# EAGLE design Cab_Board (EAGLE 8.3.2)
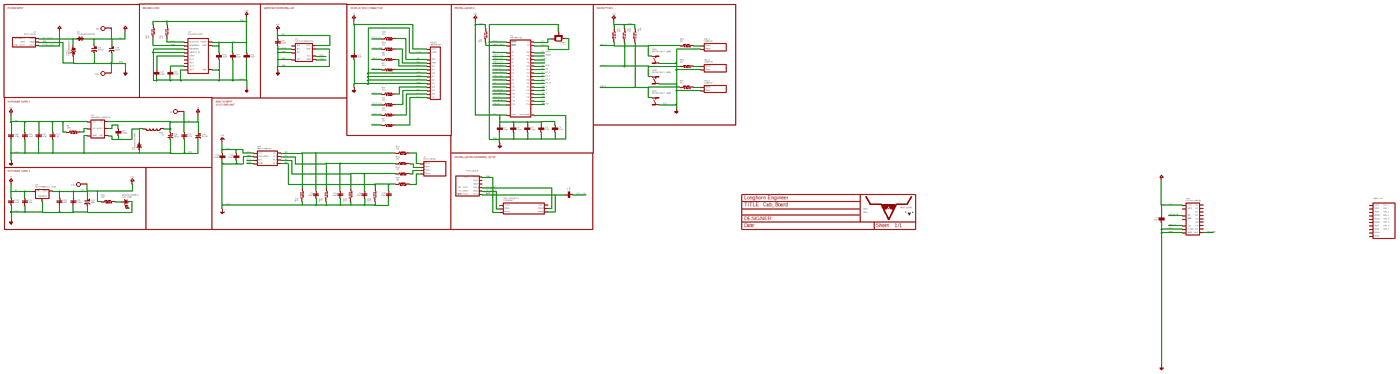
[diagram p0: schematic, sheet 1, overview]
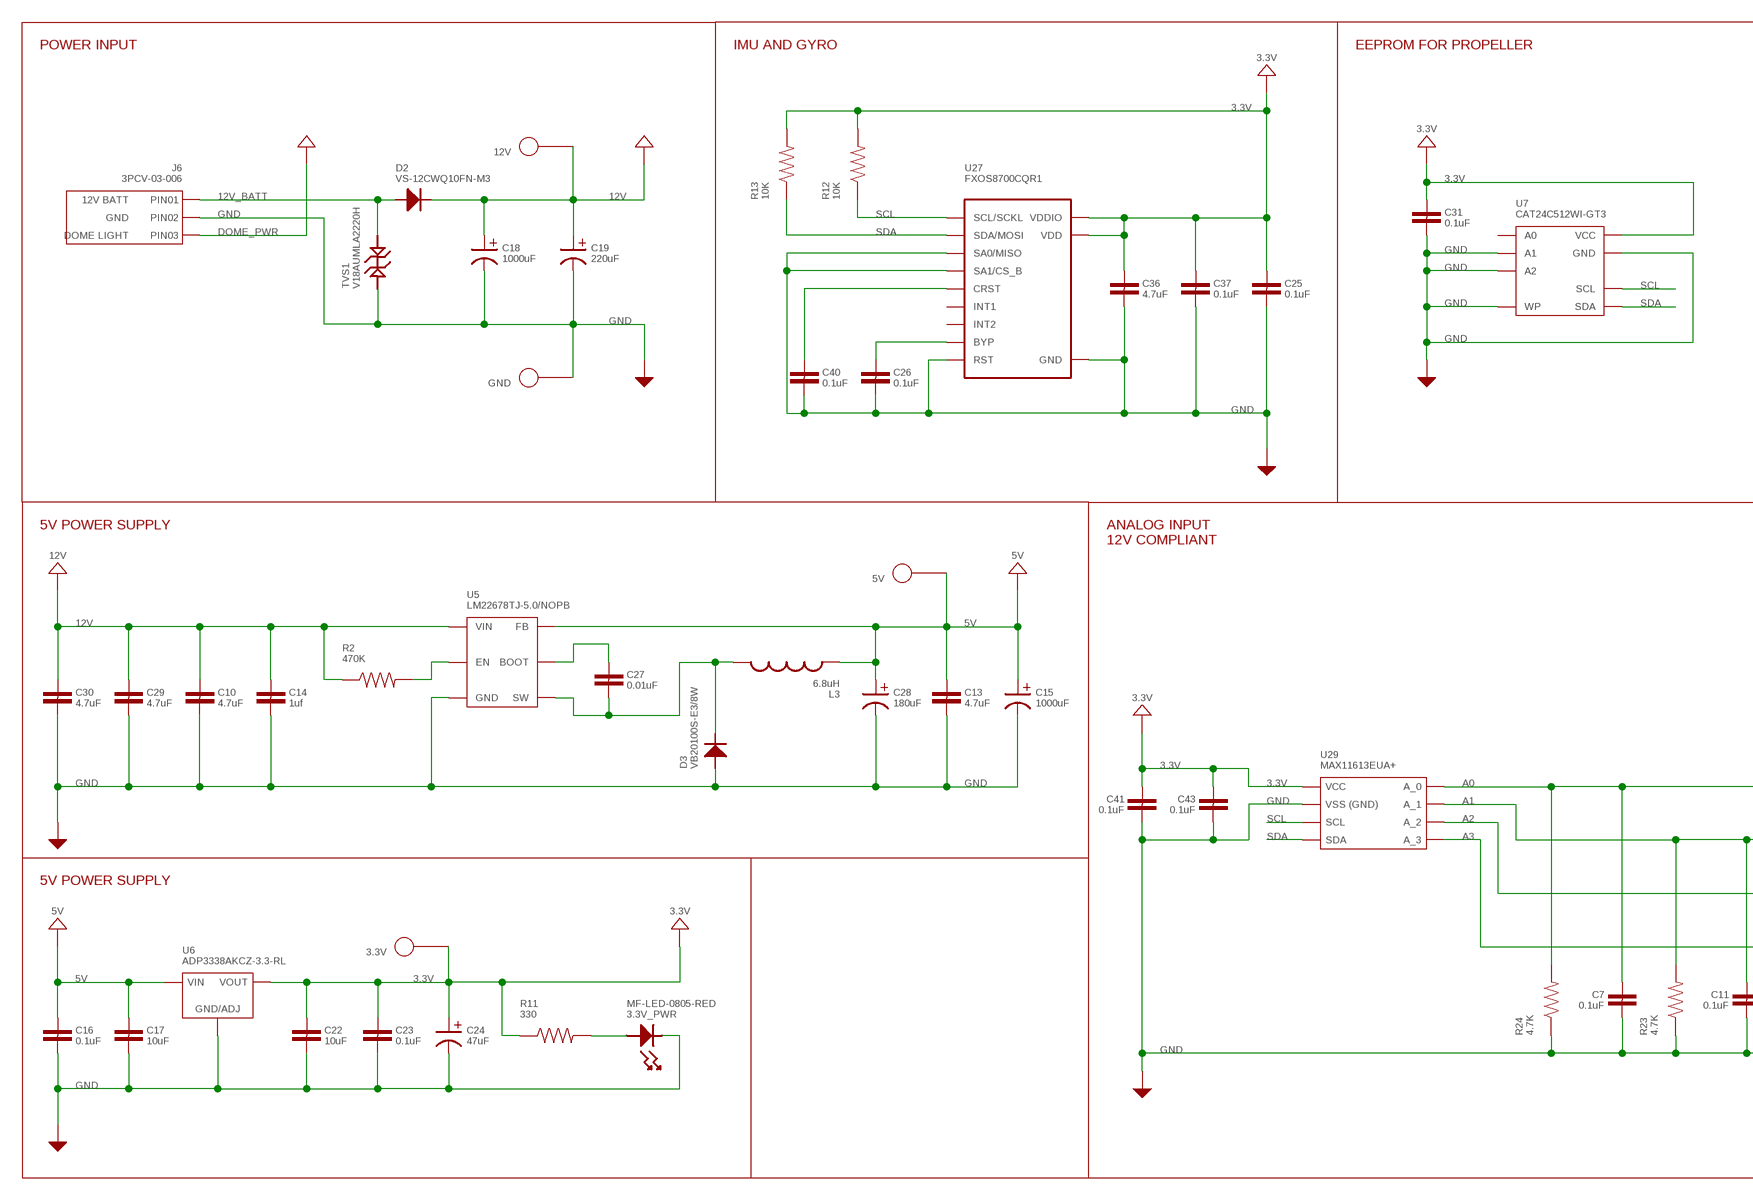
[diagram p1: schematic, sheet 1, part 1 of 4]
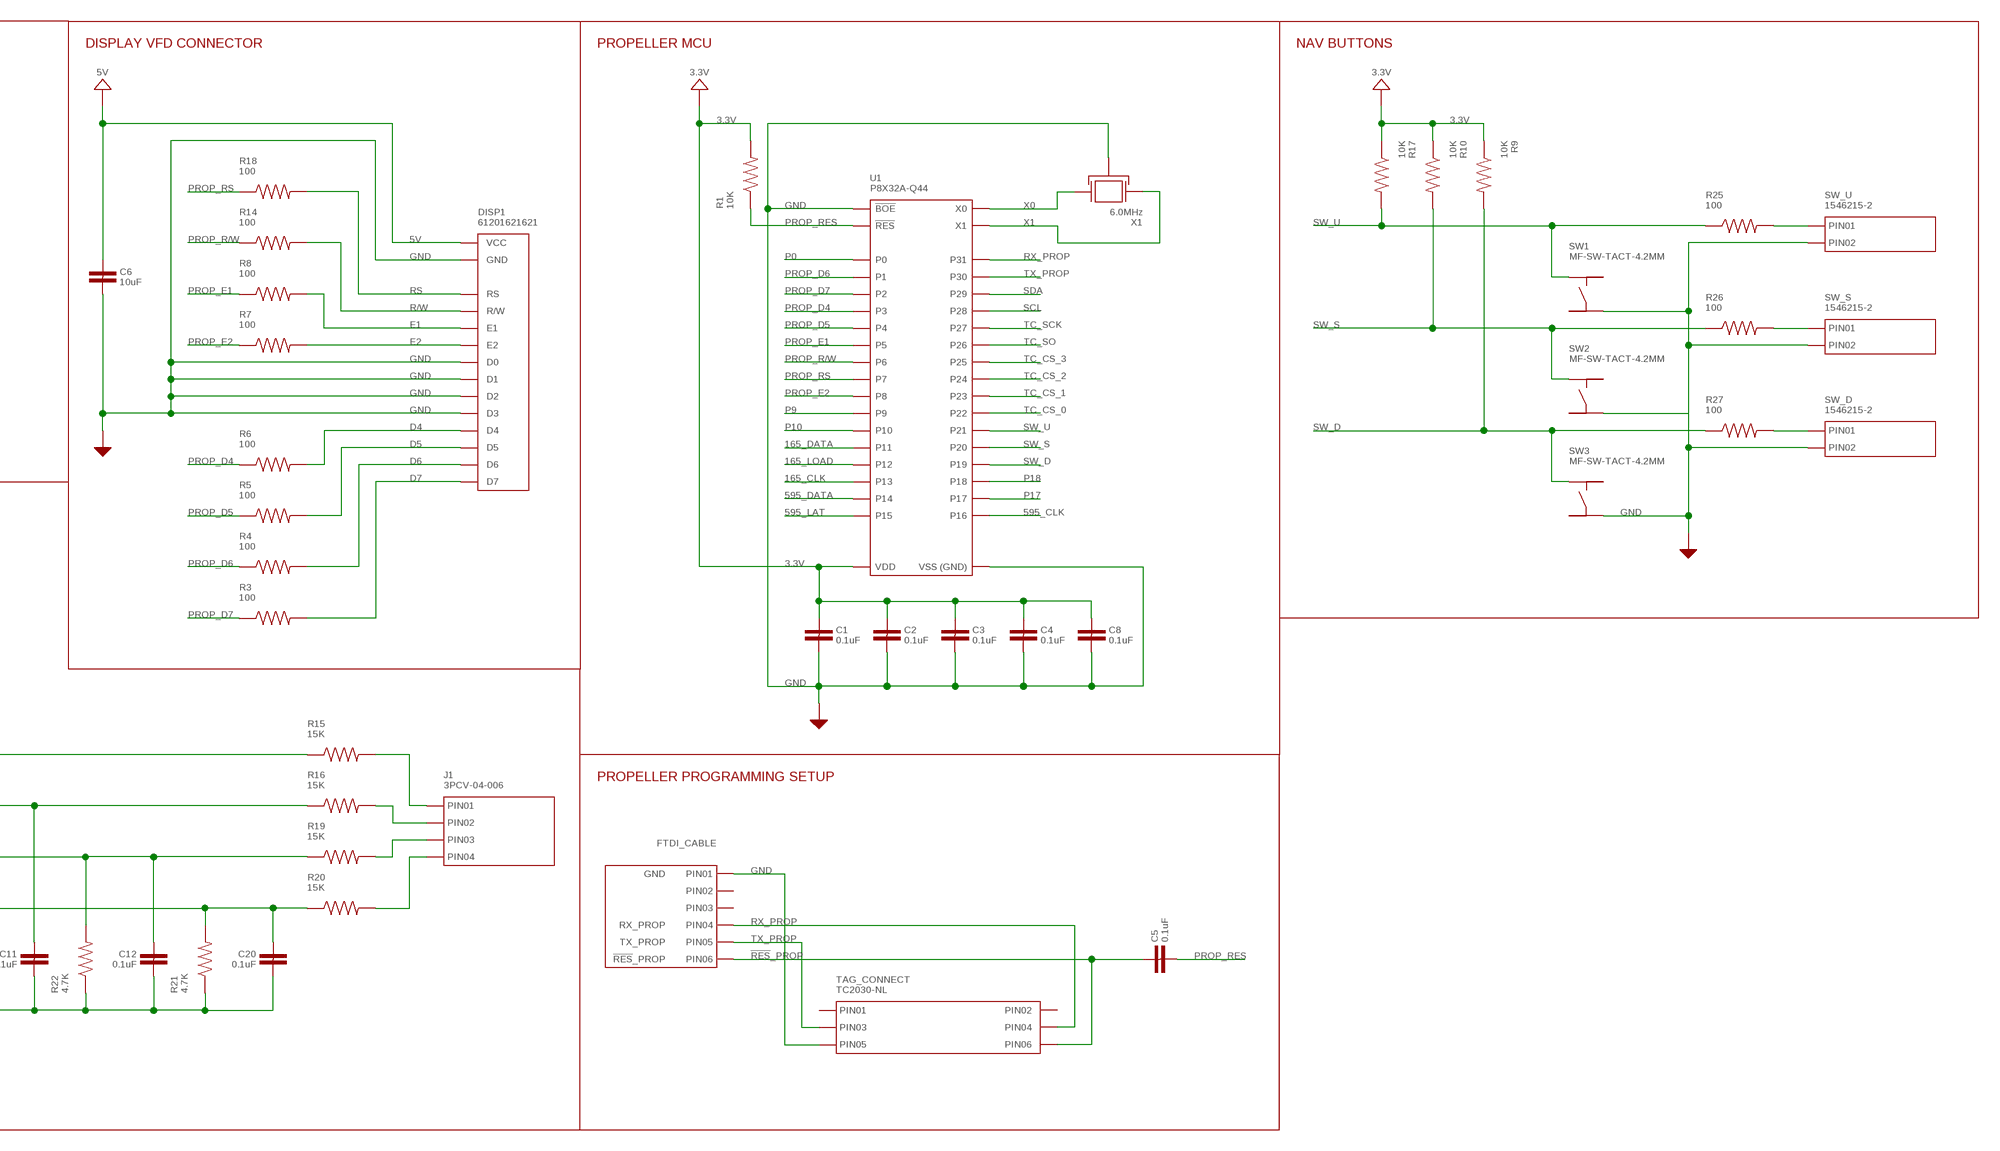
[diagram p2: schematic, sheet 1, part 2 of 4]
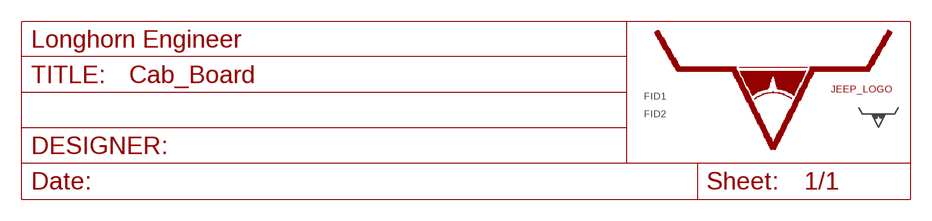
[diagram p3: schematic, sheet 1, part 3 of 4]
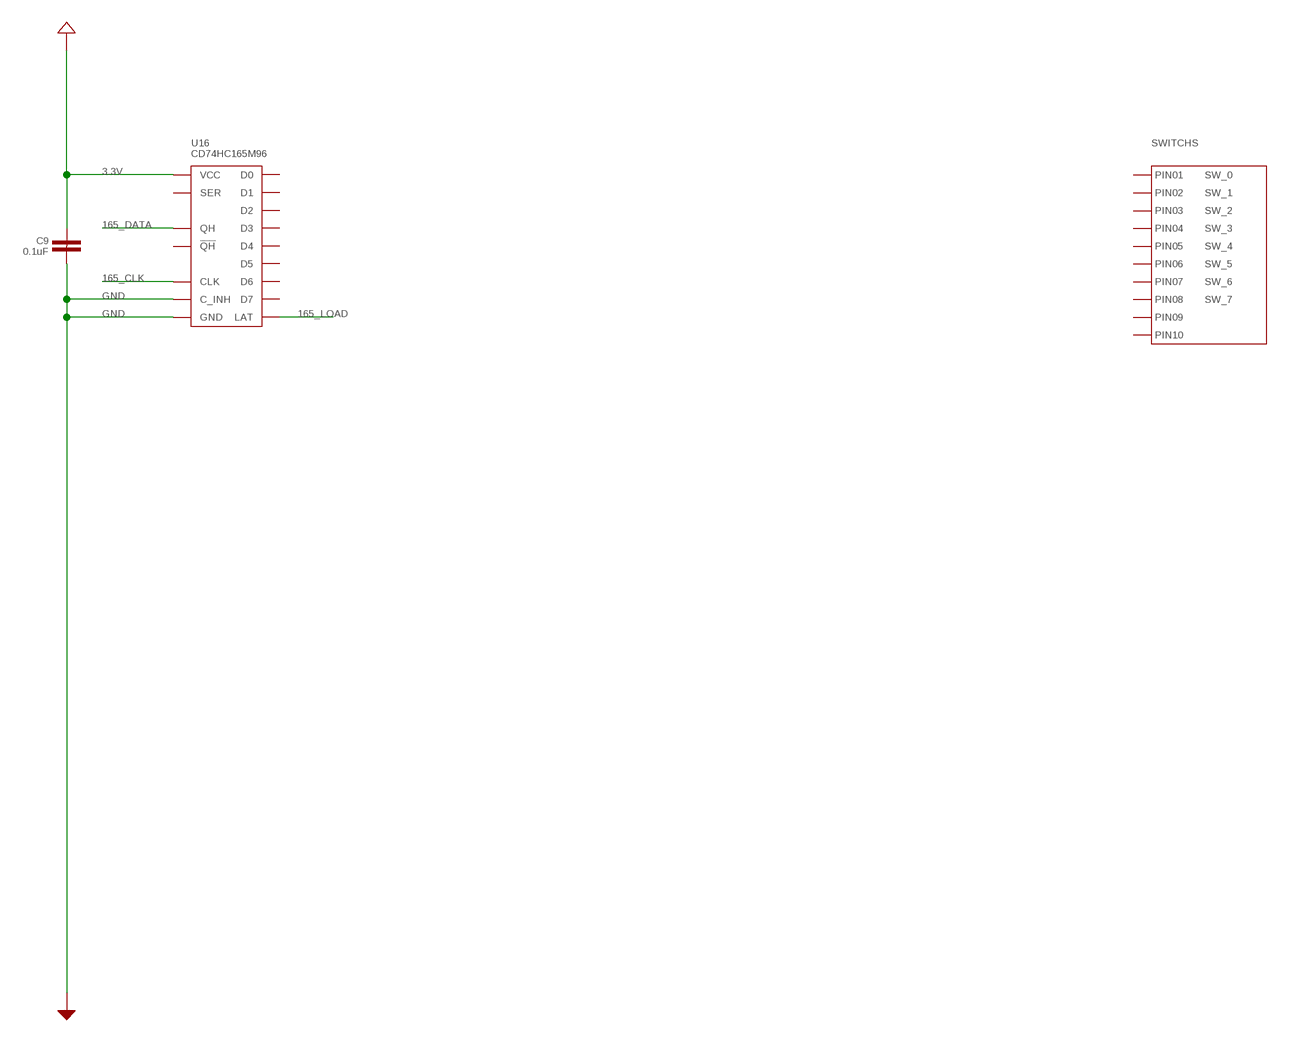
[diagram p4: schematic, sheet 1, part 4 of 4]

## Parts
3.3V  TEST_POINT_SINGLE_KEYSTONE_5115-5119  [KEYSTONE_5115-5119]
3.3V_PWR  MF-LED-0805-RED  LED_SINGLE_0805  [LED_0805]
5V  TEST_POINT_SINGLE_KEYSTONE_5115-5119  [KEYSTONE_5115-5119]
12V  TEST_POINT_SINGLE_KEYSTONE_5115-5119  [KEYSTONE_5115-5119]
C1  0.1uF  CAPACITOR_NON_POLAR_0805  [0805]
C2  0.1uF  CAPACITOR_NON_POLAR_0805  [0805]
C3  0.1uF  CAPACITOR_NON_POLAR_0805  [0805]
C4  0.1uF  CAPACITOR_NON_POLAR_0805  [0805]
C5  0.1uF  CAPACITOR_NON_POLAR_0603  [0603]
C6  10uF  CAPACITOR_NON_POLAR_1206  [1206]
C7  0.1uF  CAPACITOR_NON_POLAR_0805  [0805]
C8  0.1uF  CAPACITOR_NON_POLAR_0805  [0805]
C9  0.1uF  CAPACITOR_NON_POLAR_0805  [0805]
C10  4.7uF  CAPACITOR_NON_POLAR_1210  [1210]
C11  0.1uF  CAPACITOR_NON_POLAR_0805  [0805]
C12  0.1uF  CAPACITOR_NON_POLAR_0805  [0805]
C13  4.7uF  CAPACITOR_NON_POLAR_1210  [1210]
C14  1uf  CAPACITOR_NON_POLAR_0805  [0805]
C15  1000uF  CAPACITOR_POLARIZED_10MM_SMD  [10MM_CAP_SMD]
C16  0.1uF  CAPACITOR_NON_POLAR_0805  [0805]
C17  10uF  CAPACITOR_NON_POLAR_1206  [1206]
C18  1000uF  CAPACITOR_POLARIZED_12.5MM_PTH  [12.5MM_CAP_PTH]
C19  220uF  CAPACITOR_POLARIZED_10MM_SMD  [10MM_CAP_SMD]
C20  0.1uF  CAPACITOR_NON_POLAR_0805  [0805]
C22  10uF  CAPACITOR_NON_POLAR_1210  [1210]
C23  0.1uF  CAPACITOR_NON_POLAR_0805  [0805]
C24  47uF  CAPACITOR_POLARIZED_6.3MM_SMD  [6.3MM_CAP_SMD]
C25  0.1uF  CAPACITOR_NON_POLAR_0805  [0805]
C26  0.1uF  CAPACITOR_NON_POLAR_0805  [0805]
C27  0.01uF  CAPACITOR_NON_POLAR_0805  [0805]
C28  180uF  CAPACITOR_POLARIZED_8MM_SMD  [8MM_CAP_SMD]
C29  4.7uF  CAPACITOR_NON_POLAR_1210  [1210]
C30  4.7uF  CAPACITOR_NON_POLAR_1210  [1210]
C31  0.1uF  CAPACITOR_NON_POLAR_0805  [0805]
C36  4.7uF  CAPACITOR_NON_POLAR_1206  [1206]
C37  0.1uF  CAPACITOR_NON_POLAR_0805  [0805]
C40  0.1uF  CAPACITOR_NON_POLAR_0805  [0805]
C41  0.1uF  CAPACITOR_NON_POLAR_0805  [0805]
C43  0.1uF  CAPACITOR_NON_POLAR_0805  [0805]
D2  VS-12CWQ10FN-M3  DIODE_D-PAK(TO-252AA)  [D-PAK(TO-252AA)]
D3  VB20100S-E3/8W  DIODE_D2PAK(TO-263AB)  [D2PAK(TO-263AB)]
DISP1  61201621621  CU40056-UW1J  [CU40045-UW1J]
FID1  FIDUCIAL_0.5MM  [FIDUCIAL_0.5MM]
FID2  FIDUCIAL_0.5MM  [FIDUCIAL_0.5MM]
FTDI_CABLE  CON_01X06_2.54MM_PIN_HEADER  [2.54MM_01X06_PIN_HEADER]
GND  TEST_POINT_SINGLE_KEYSTONE_5115-5119  [KEYSTONE_5115-5119]
J1  3PCV-04-006  CON_01X04_3PCV-04-006  [3PCV-04-006]
J6  3PCV-03-006  CON_01X03_3PV-03-006  [3PCV-03-006]
L3  6.8uH  INDUCTOR_IHLP-5050  [IHLP-5050]
R1  10K  RESISTOR_0805  [0805]
R2  470K  RESISTOR_0603  [0603]
R3  100  RESISTOR_0603  [0603]
R4  100  RESISTOR_0603  [0603]
R5  100  RESISTOR_0603  [0603]
R6  100  RESISTOR_0603  [0603]
R7  100  RESISTOR_0603  [0603]
R8  100  RESISTOR_0603  [0603]
R9  10K  RESISTOR_0603  [0603]
R10  10K  RESISTOR_0603  [0603]
R11  330  RESISTOR_0603  [0603]
R12  10K  RESISTOR_0603  [0603]
R13  10K  RESISTOR_0603  [0603]
R14  100  RESISTOR_0603  [0603]
R15  15K  RESISTOR_0603  [0603]
R16  15K  RESISTOR_0603  [0603]
R17  10K  RESISTOR_0603  [0603]
R18  100  RESISTOR_0603  [0603]
R19  15K  RESISTOR_0603  [0603]
R20  15K  RESISTOR_0603  [0603]
R21  4.7K  RESISTOR_0603  [0603]
R22  4.7K  RESISTOR_0603  [0603]
R23  4.7K  RESISTOR_0603  [0603]
R24  4.7K  RESISTOR_0603  [0603]
R25  100  RESISTOR_0603  [0603]
R26  100  RESISTOR_0603  [0603]
R27  100  RESISTOR_0603  [0603]
SW1  MF-SW-TACT-4.2MM  TACT_4.2MM  [TACT4.2MM]
SW2  MF-SW-TACT-4.2MM  TACT_4.2MM  [TACT4.2MM]
SW3  MF-SW-TACT-4.2MM  TACT_4.2MM  [TACT4.2MM]
SW_D  1546215-2  CON_01X02_1546215-2  [1546215-2]
SW_S  1546215-2  CON_01X02_1546215-2  [1546215-2]
SW_U  1546215-2  CON_01X02_1546215-2  [1546215-2]
SWITCHS  CON_01X10_1-282834-0  [1-282834-0]
TAG_CONNECT  TC2030-NL  CON_02X03_TC2030  [TC2030]
TVS1  V18AUMLA2220H  TVS_DIODE_2220  [2220]
U1  P8X32A-Q44  [LQFP44]
U5  LM22678TJ-5.0/NOPB  LM22678  [LM22678_TO-263-EP-7]
U6  ADP3338AKCZ-3.3-RL  LINEAR_VOTLAGE_REGULATORS_ADP3338  [ADP3338_SOT-223-3]
U7  CAT24C512WI-GT3  EEPROM_I2CSOIC-8_W  [SOIC-8_W]
U16  CD74HC165M96  [CD74HC165_SOIC-16]
U27  FXOS8700CQR1  [FXOS8700CQR1]
U29  MAX11613EUA+  [MAX11613_UMAX-8]
U$1  LHE_FRAME  [LHE_FRAME]
U$35  JEEP_LOGO_SILK_MEDIUM  [JEEP_SILK_MEDIUM]
U$42  LHE_LOGOLHE_LOGO  [LHE_LOGO]
X1  6.0MHz  CYRSTAL_GND_ABMM  [7MMX5MM]

## Nets
3.3V: 3.3V.P$1 C1.1 C2.1 C3.1 C4.1 C8.1 C9.1 C22.1 C23.1 C24.POS C25.1 C31.1 C36.1 C37.1 C41.1 C43.1 R1.2 R9.1 R10.1 R11.1 R12.2 R13.2 R17.1 U1.8(VDD) U1.18(VDD) U1.30(VDD) U1.40(VDD) U6.2(OUT) U6.PAD(OUT) U7.8(VCC) U16.16(VCC) U27.P$1(VDDIO) U27.P$14(VDD) U29.P$8(VCC)
5V: 5V.P$1 C6.1 C13.1 C15.POS C16.1 C17.1 C28.POS DISP1.P$13(VCC) L3.1 U5.P$6(FB) U6.3(IN)
12V: 12V.P$1 C10.1 C14.1 C18.POS C19.POS C29.1 C30.1 D2.PAD-4(CATHODE) R2.1 U5.P$2(VIN)
12V_BATT: D2.1(ANODE) D2.3(ANODE) J6.1(PIN1) TVS1.P$2
165_CLK: U1.14(P13) U16.2(CLK)
165_DATA: U1.12(P11) U16.9(QH)
165_LOAD: U1.13(P12) U16.1(LAT)
595_CLK: U1.19(P16)
595_DATA: U1.15(P14)
595_LAT: U1.16(P15)
!RES!_PROP: C5.1 FTDI_CABLE.6 TAG_CONNECT.P$6(PIN6)
A0: C7.1 R15.1 R24.2 U29.P$1(A_0)
A1: C11.1 R16.1 R23.2 U29.P$2(A_1)
A2: C12.1 R19.1 R22.2 U29.P$3(A_2)
A3: C20.1 R20.1 R21.2 U29.P$4(A_3)
D4: DISP1.P$3(D4) R6.2
D5: DISP1.P$4(D5) R5.2
D6: DISP1.P$1(D6) R4.2
D7: DISP1.P$2(D7) R3.2
DOME_PWR: J6.3(PIN3)
E1: DISP1.P$10(E1) R8.2
E2: DISP1.P$16(E2) R7.2
GND: 3.3V_PWR.CATHODE C1.2 C2.2 C3.2 C4.2 C6.2 C7.2 C8.2 C9.2 C10.2 C11.2 C12.2 C13.2 C14.2 C15.NEG C16.2 C17.2 C18.NEG C19.NEG C20.2 C22.2 C23.2 C24.NEG C25.2 C26.2 C28.NEG C29.2 C30.2 C31.2 C36.2 C37.2 C40.2 C41.2 C43.2 D3.A(ANODE) DISP1.P$5(D2) DISP1.P$6(D3) DISP1.P$7(D0) DISP1.P$8(D1) DISP1.P$14(GND) FTDI_CABLE.1 GND.P$1 J6.2(PIN2) R21.1 R22.1 R23.1 R24.1 SW1.P$4 SW2.P$4 SW3.P$4 SW_D.P$2(PIN2) SW_S.P$2(PIN2) SW_U.P$2(PIN2) TAG_CONNECT.P$5(PIN5) TVS1.P$1 U1.5(VSS) U1.6(BOE') U1.17(VSS) U1.27(VSS) U1.39(VSS) U5.P$4(GND) U5.PAD(GND) U6.1(GND) U7.2(A1) U7.3(A2) U7.4(GND) U7.7(WP) U16.8(GND) U16.15(C_INH) U27.P$3(GND) U27.P$5(GND) U27.P$7(SA0/MISO) U27.P$10(SA1/CS_B) U27.P$12(GND) U27.P$13(GND) U27.P$16(RST) U29.P$7(GND) X1.P$2(GND) X1.P$4(GND)
N$1: J1.1 R15.2
N$2: C27.1 U5.P$3(BOOT)
N$3: J1.2 R16.2
N$4: J1.3 R19.2
N$5: C27.2 D3.C(CATHODE) L3.2 U5.P$1(SW)
N$6: J1.4 R20.2
N$7: C26.1 U27.P$2(BYP)
N$8: C40.1 U27.P$8(CRST)
N$9: 3.3V_PWR.ANODE R11.2
N$10: R25.2 SW_U.P$1(PIN1)
N$11: R26.2 SW_S.P$1(PIN1)
N$12: R27.2 SW_D.P$1(PIN1)
N$31: R2.2 U5.P$7(EN)
P0: U1.41(P0)
P9: U1.10(P9)
P10: U1.11(P10)
P17: U1.20(P17)
P18: U1.21(P18)
PROP_D4: R6.1 U1.44(P3)
PROP_D5: R5.1 U1.1(P4)
PROP_D6: R4.1 U1.42(P1)
PROP_D7: R3.1 U1.43(P2)
PROP_E1: R8.1 U1.2(P5)
PROP_E2: R7.1 U1.9(P8)
PROP_R/W: R14.1 U1.3(P6)
PROP_RES: C5.2 R1.1 U1.7(RES')
PROP_RS: R18.1 U1.4(P7)
R/W: DISP1.P$9(R/W) R14.2
RS: DISP1.P$12(RS) R18.2
RX_PROP: FTDI_CABLE.4 TAG_CONNECT.P$4(PIN4) U1.38(P31)
SCL: R12.1 U1.35(P28) U7.6(SCL) U27.P$4(SCL/SCKL) U29.P$5(SCL)
SDA: R13.1 U1.36(P29) U7.5(SDA) U27.P$6(SDA/MOSI) U29.P$6(SDA)
SW_D: R9.2 R27.1 SW3.P$1 U1.22(P19)
SW_S: R10.2 R26.1 SW2.P$1 U1.23(P20)
SW_U: R17.2 R25.1 SW1.P$1 U1.24(P21)
TC_CS_0: U1.25(P22)
TC_CS_1: U1.26(P23)
TC_CS_2: U1.31(P24)
TC_CS_3: U1.32(P25)
TC_SCK: U1.34(P27)
TC_SO: U1.33(P26)
TX_PROP: FTDI_CABLE.5 TAG_CONNECT.P$3(PIN3) U1.37(P30)
X0: U1.29(X0) X1.P$3(X1)
X1: U1.28(X1) X1.P$1(X0)
Unconnected: FTDI_CABLE.2 FTDI_CABLE.3 SW1.P$2 SW1.P$3 SW2.P$2 SW2.P$3 SW3.P$2 SW3.P$3 SWITCHS.P$1 SWITCHS.P$2 SWITCHS.P$3 SWITCHS.P$4 SWITCHS.P$5 SWITCHS.P$6 SWITCHS.P$7 SWITCHS.P$8 SWITCHS.P$9 SWITCHS.P$10 TAG_CONNECT.P$1(PIN1) TAG_CONNECT.P$2(PIN2) U7.1(A0) U16.3(D4) U16.4(D5) U16.5(D6) U16.6(D7) U16.7(QH') U16.10(SER) U16.11(D0) U16.12(D1) U16.13(D2) U16.14(D3) U27.P$9(INT2) U27.P$11(INT1)

## Notes on the sheet
- POWER INPUT | IMU AND GYRO | EEPROM FOR PROPELLER | DISPLAY VFD CONNECTOR | PROPELLER MCU | NAV BUTTONS
- 5V POWER SUPPLY
- ANALOG INPUT
  12V COMPLIANT
- PROPELLER PROGRAMMING SETUP
- 5V POWER SUPPLY

## Library data of the parts
3.3V = PP_Connectors:TEST_POINT_SINGLE; POPULATE: 1
3.3V_PWR = PP_LED:LED_SINGLE; MPN: MF-LED-0805-RED
5V 12V GND = PP_Connectors:TEST_POINT_SINGLE; MPN: 5115; POPULATE: 1
C1-C5 C7 C8 C11 C12 C16 C20 C23 C25 C26 C31 C37 C40 C41 C43 = PP_Passives:CAPACITOR_NON_POLAR: Capacitor Non Polarized; MPN: MF-CAP-0805-0.1uF
C6 C17 C22 = PP_Passives:CAPACITOR_NON_POLAR: Capacitor Non Polarized; MPN: MF-CAP-1206-10uF
C9 = PP_Passives:CAPACITOR_NON_POLAR: Capacitor Non Polarized
C10 C13 C29 C30 C36 = PP_Passives:CAPACITOR_NON_POLAR: Capacitor Non Polarized; MPN: GRJ32DC72A475KE11L
C14 = PP_Passives:CAPACITOR_NON_POLAR: Capacitor Non Polarized; MPN: C0805C105K5RACTU
C15 = PP_Passives:CAPACITOR_POLARIZED: Polarized capacitors; MPN: UWZ1A102MCL1GS
C18 = PP_Passives:CAPACITOR_POLARIZED: Polarized capacitors; MPN: UBW1H102MHD
C19 = PP_Passives:CAPACITOR_POLARIZED: Polarized capacitors; MPN: UWZ1H221MCL1GS
C24 = PP_Passives:CAPACITOR_POLARIZED: Polarized capacitors; MPN: UWJ1C470MCL1GB
C27 = PP_Passives:CAPACITOR_NON_POLAR: Capacitor Non Polarized; MPN: C0805C103K5RACTU
C28 = PP_Passives:CAPACITOR_POLARIZED: Polarized capacitors; MPN: 16SVP180M
D2 = PP_Passives:DIODE: Diode - Single; MPN: VS-12CWQ10FN-M3
D3 = PP_Passives:DIODE: Diode - Single
DISP1 = PP_Displays:CU40056-UW1J; MPN: 61201621621
FID1 FID2 = MF_Aesthetics:FIDUCIAL: Library: MF_Aesthetics Description: Fiducial marking for PCB alignment inside PNP and other machines.; HOUSEPART: NO; POPULATE: 0
FTDI_CABLE = PP_Connectors:CON_01X06: 6 pin connectors; LABEL01: GND; LABEL04: RX_PROP; LABEL05: TX_PROP; LABEL06: !RES!_PROP; POPULATE: 1
J1 = PP_Connectors:CON_01X04: 4 Pin Connectors; LABEL01: ANALOG 0; LABEL02: ANALOG 1; LABEL03: ANALOG 3; LABEL04: ANALOG 4; MPN: 3PCV-04-006
J6 = PP_Connectors:CON_01X03: 3 pin connectors; LABEL01: 12V BATT; LABEL02: GND; LABEL03: DOME LIGHT; MPN: 3PCV-03-006; POPULATE: 1
L3 = PP_Passives:INDUCTOR: Inductors; MPN: IHLP5050CEER6R8M01
R1 = PP_Passives:RESISTOR: Resistors
R2 = PP_Passives:RESISTOR: Resistors; MPN: MF-RES-0603-470K
R3-R8 R14 R18 R25-R27 = PP_Passives:RESISTOR: Resistors; MPN: MF-RES-0603-100
R9 R10 R12 R13 R17 = PP_Passives:RESISTOR: Resistors; MPN: MF-RES-0603-10K
R11 = PP_Passives:RESISTOR: Resistors; MPN: MF-RES-0603-330
R15 R16 R19 R20 = PP_Passives:RESISTOR: Resistors; MPN: MF-RES-0603-15K
R21-R24 = PP_Passives:RESISTOR: Resistors; MPN: MF-RES-0603-4.7K
SW1-SW3 = MF_Switches:TACT: Library: MF_Switches Description: Device for Tact Switches. Manufacture part number (MFG#) can be added via Attributes.; HOUSEPART: YES; MPN: MF-SW-TACT-4.2MM; POPULATE: 1; URL: https://factory.macrofab.com/part/MF-SW-TACT-4.2MM
SW_D SW_S SW_U = PP_Connectors:CON_01X02; MPN: 1546215-2; POPULATE: 1
SWITCHS = PP_Connectors:CON_01X10; LABEL01: SW_0; LABEL02: SW_1; LABEL03: SW_2; LABEL04: SW_3; LABEL05: SW_4; LABEL06: SW_5; LABEL07: SW_6; LABEL08: SW_7; POPULATE: 1
TAG_CONNECT = PP_Connectors:CON_02X03; POPULATE: 0
TVS1 = PP_Passives:TVS_DIODE
U1 = MF_IC_Digital:P8X32A: Manufacturer Part #: P8X32A Manufacturer: Parallax Description: 32-bit Microcontrollers - MCU LQFP pkg Propeller Chip; HOUSEPART: NO; MPN: P8X32A-Q44; POPULATE: 1; URL: https://www.parallax.com/sites/default/files/downloads/P8X32A-Propeller-Datasheet-v1.4.0_0.pdf
U5 = PP_PowerIC:LM22678: Manufacturer Part #: LM22678 Manufacturer: Texas Instruments Description: Voltage Regulators - Switching Regulators 5A STEP-DOWN VLTG REG; MPN: LM22678TJ-5.0/NOPB
U6 = PP_PowerIC:LINEAR_VOTLAGE_REGULATORS; MPN: ADP3338AKCZ-3.3-RL
U7 = PP_DigitalIC:EEPROM_I2C; MPN: CAT24C512WI-GT3
U16 = PP_DigitalIC:CD74HC165: Manufacturer Part #: CD74HC165 Manufacturer: Texas Instruments Description: Counter Shift Registers High Speed CMOS 8-Bit Shift Register
U27 = PP_Sensors:FXOS8700CQR1; MPN: FXOS8700CQR1
U29 = PP_AnalogIC:MAX11613: Manufacturer Part #: MAX11613 Manufacturer: Maxim Integrated Description: Analog to Digital Converters - ADC 12-Bit 4Ch 94.4sps 3.6V Precision ADC; MPN: MAX11613EUA+; POPULATE: 1
U$1 = PP_Aesthetics:LHE_FRAME; DNAME: Parker Dillmann; REVNUM: REV: 1
U$35 = PP_Aesthetics:JEEP_LOGO
U$42 = PP_Aesthetics:LHE_LOGO
X1 = MF_Frequency_Control:CYRSTAL_GND: Library: MF_Frequency_Control Description: Device for two functional pin Cyrstal Oscillators and a ground.; HOUSEPART: NO; MPN: ABMM-6.000MHZ-B2-T; POPULATE: 1; URL: http://www.abracon.com/Resonators/ABMM.pdf

## Board
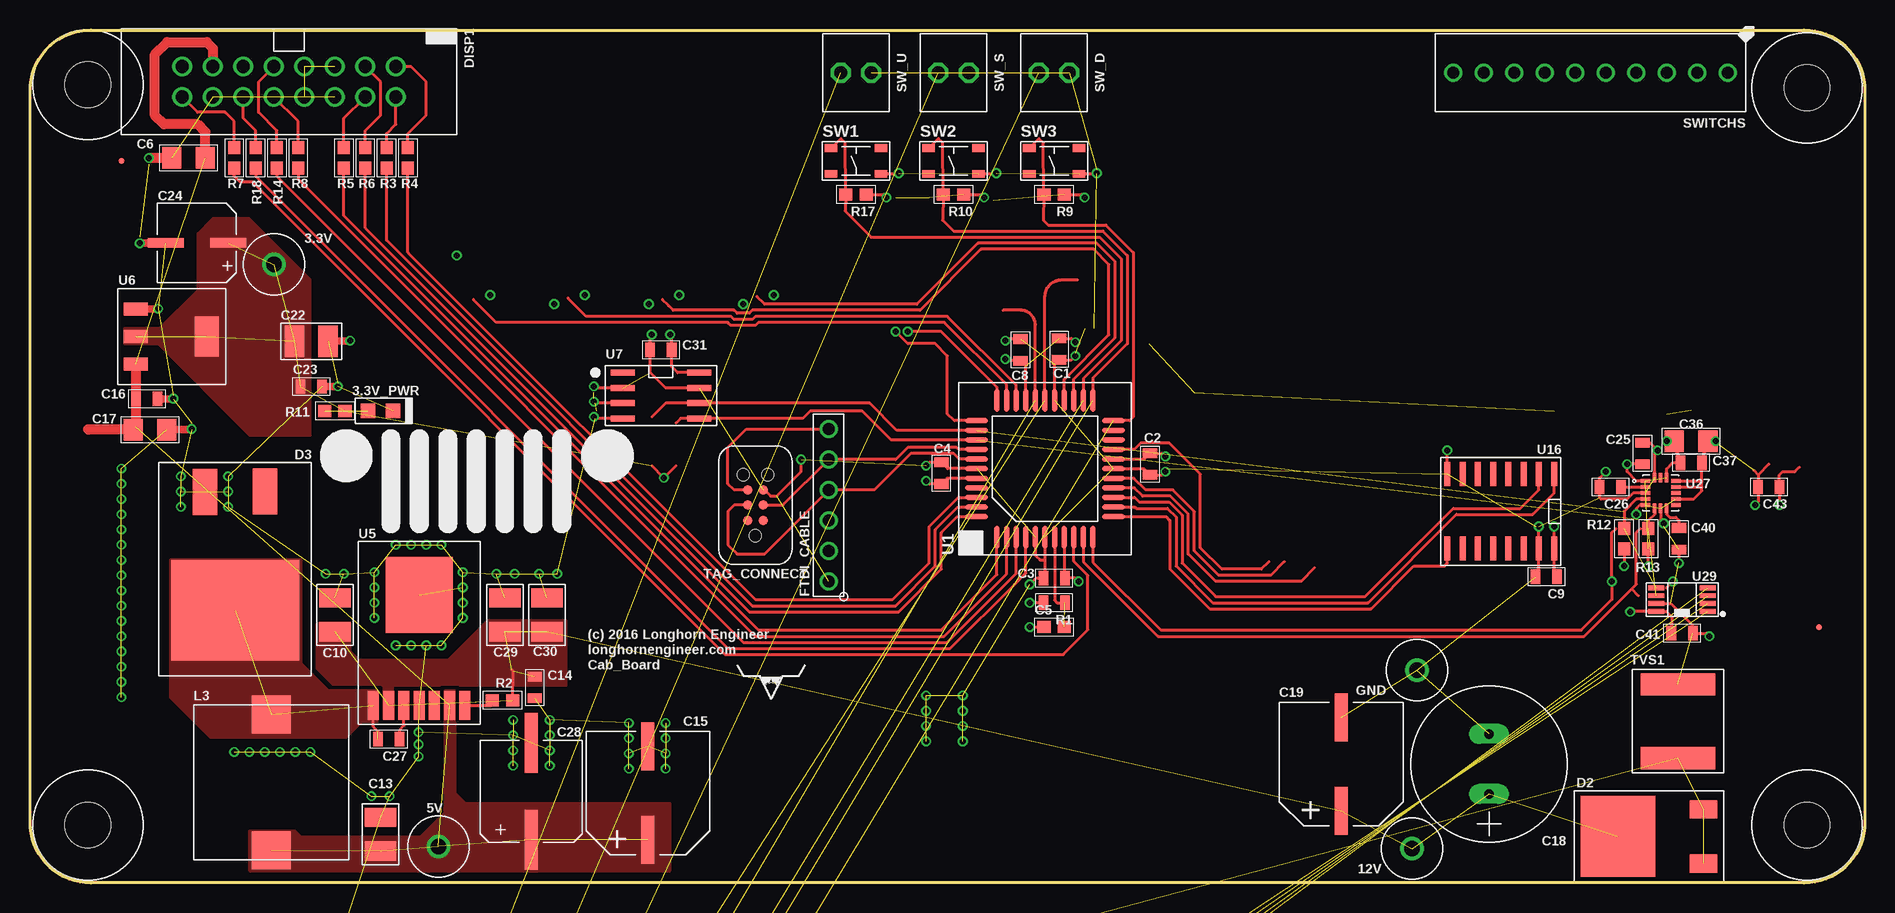
[diagram p5: board, top side]
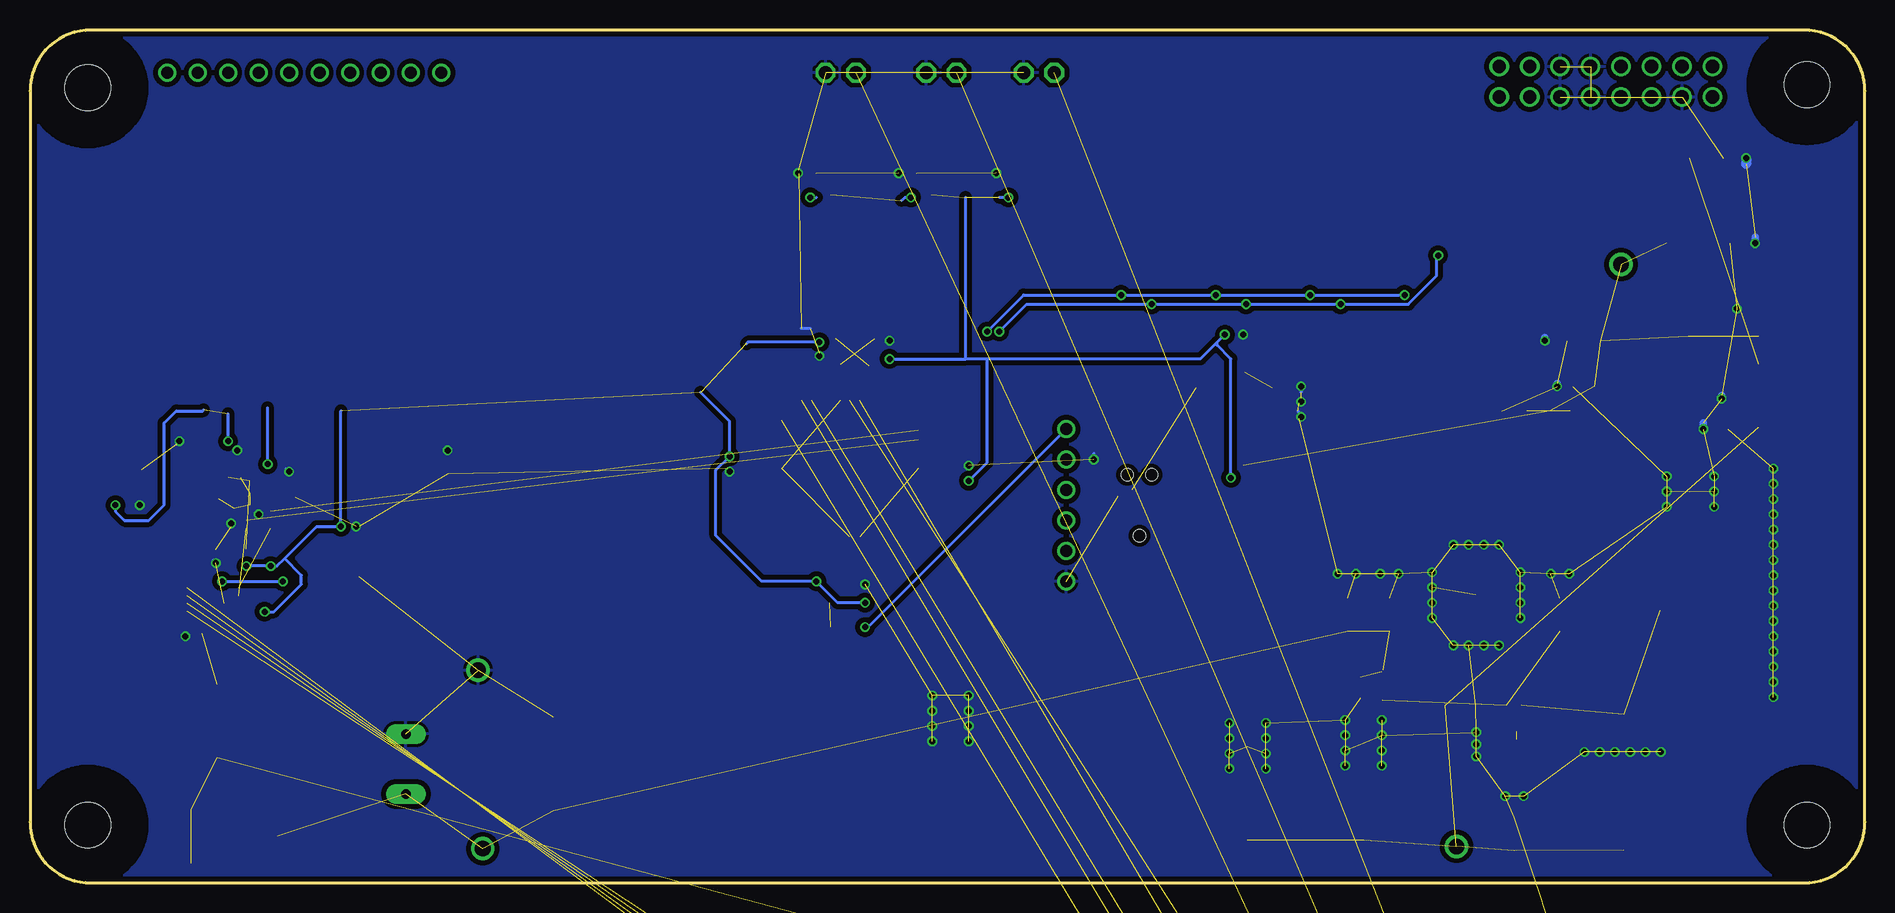
[diagram p6: board, bottom side, seen from below]

Size 152.91 x 71.12 mm. Coordinates in mm from the lower left corner, seen from the top.
Outline: 0,5.08 0,66.04 arc-90 5.08,71.12 147.83,71.12 arc-90 152.91,66.04 152.91,5.08 arc-90 147.83,0 5.08,0 arc-90 0,5.08
Copper layers (1*16): Top 0.035mm / dielectric 1.5mm / Bottom 0.035mm
Design rules "MF_Standard_2_Layer": minimum track width 6mil, minimum drill 12mil, track to track 6mil, track to pad 6mil, pad to pad 6mil, via to via 6mil, smd to smd 0mil, copper to edge 10mil, drill to drill 10mil, minimum pad ring 6mil, minimum via ring 6mil, stop-mask expansion 2mil, vias tented up to drill 25mil, thermal gap 10mil

### Footprints (pad centres in the part's own frame; a part is rotated, then mirrored left to right if it is on the bottom)
KEYSTONE_5115-5119 = drill 1.3: P$1 0,0
LED_0805 = smd 1.2 x 1.2: ANODE 1.05,0; CATHODE -1.05,0
0805 = smd 0.8 x 1.2: 1 -0.9,0; 2 0.9,0
0603 = smd 1.1 x 1: 1 -0.85,0; 2 0.85,0
1206 = smd 1.6 x 1.8: 1 -1.4,0; 2 1.4,0
1210 = smd 1.6 x 2.6: 1 -1.4,0; 2 1.4,0
10MM_CAP_SMD = smd 1.1 x 4: NEG 0,-3.88; POS 0,3.88
12.5MM_CAP_PTH = drill 0.8 pad 1.676 long: NEG 0,-2.5; POS 0,2.5
6.3MM_CAP_SMD = smd 0.8 x 3: NEG 0,-2.6; POS 0,2.6
8MM_CAP_SMD = smd 1.1 x 5: NEG 0,-4.05; POS 0,4.05
D-PAK(TO-252AA) = smd 1.524 x 2.286: 1 -2.261,-10.249; 3 2.261,-10.249 | smd 6.731 x 6.223: PAD-4 0,-3.111
D2PAK(TO-263AB) = smd 2.032 x 3.81: A 2.5,-5.169; NOP -2.5,-5.205 | smd 10.66 x 8.38: C 0,4.7
CU40045-UW1J = drill 1.1: P$1 -1.27,8.89; P$2 1.27,8.89; P$3 -1.27,6.35; P$4 1.27,6.35; P$5 -1.27,3.81; P$6 1.27,3.81; P$7 -1.27,1.27; P$8 1.27,1.27; P$9 -1.27,-1.27; P$10 1.27,-1.27; P$11 -1.27,-3.81; P$12 1.27,-3.81; P$13 -1.27,-6.35; P$14 1.27,-6.35; P$15 -1.27,-8.89; P$16 1.27,-8.89
FIDUCIAL_0.5MM = smd 0.5 x 0.5: FID 0,0
2.54MM_01X06_PIN_HEADER = drill 1: 1 -6.35,0; 2 -3.81,0; 3 -1.27,0; 4 1.27,0; 5 3.81,0; 6 6.35,0
3PCV-04-006 = drill 1.854 long: 1 -9.525,0; 2 -3.175,0; 3 3.175,0; 4 9.525,0
3PCV-03-006 = drill 1.854 long: 1 -6.35,0; 2 0,0; 3 6.35,0
IHLP-5050 = smd 3.175 x 3.251: 1 -5.664,0; 2 5.664,0
TACT4.2MM = smd 1.05 x 0.65: P$1 -2.075,1.075; P$2 2.075,1.075; P$3 -2.075,-1.075; P$4 2.075,-1.075
1546215-2 = drill 1.1 octagon: P$1 -1.27,0; P$2 1.27,0
1-282834-0 = drill 1: P$1 -11.43,0; P$2 -8.89,0; P$3 -6.35,0; P$4 -3.81,0; P$5 -1.27,0; P$6 1.27,0; P$7 3.81,0; P$8 6.35,0; P$9 8.89,0; P$10 11.43,0
TC2030 = smd 0.787 x 0.787: P$1 -1.27,-0.635; P$2 -1.27,0.635; P$3 0,-0.635; P$4 0,0.635; P$5 1.27,-0.635; P$6 1.27,0.635 | hole 0.991: 2.54,1.016; 2.54,-1.016; -2.54,0
2220 = smd 1.85 x 6.2: P$1 -3.075,0; P$2 3.075,0
LQFP44 = smd 1.9 x 0.4: 1 -5.7,4; 2 -5.7,3.2; 3 -5.7,2.4; 4 -5.7,1.6; 5 -5.7,0.8; 6 -5.7,0; 7 -5.7,-0.8; 8 -5.7,-1.6; 9 -5.7,-2.4; 10 -5.7,-3.2; 11 -5.7,-4; 23 5.7,-4; 24 5.7,-3.2; 25 5.7,-2.4; 26 5.7,-1.6; 27 5.7,-0.8; 28 5.7,0; 29 5.7,0.8; 30 5.7,1.6; 31 5.7,2.4; 32 5.7,3.2; 33 5.7,4 | smd 0.4 x 1.9: 12 -4,-5.7; 13 -3.2,-5.7; 14 -2.4,-5.7; 15 -1.6,-5.7; 16 -0.8,-5.7; 17 0,-5.7; 18 0.8,-5.7; 19 1.6,-5.7; 20 2.4,-5.7; 21 3.2,-5.7; 22 4,-5.7; 34 4,5.7; 35 3.2,5.7; 36 2.4,5.7; 37 1.6,5.7; 38 0.8,5.7; 39 0,5.7; 40 -0.8,5.7; 41 -1.6,5.7; 42 -2.4,5.7; 43 -3.2,5.7; 44 -4,5.7
LM22678_TO-263-EP-7 = smd 0.91 x 2.41: P$1 -3.81,-12.4; P$2 -2.54,-12.4; P$3 -1.27,-12.4; P$4 0,-12.4; P$5 1.27,-12.4; P$6 2.54,-12.4; P$7 3.81,-12.4 | smd 5.59 x 6.35: PAD 0,-3.175
ADP3338_SOT-223-3 = smd 1.1 x 2: 1 -2.3,-2.54; 2 0,-2.54; 3 2.3,-2.54 | smd 3.3 x 2: PAD 0,3.36
SOIC-8_W = smd 2 x 0.5: 1 -3.185,1.905; 2 -3.185,0.635; 3 -3.185,-0.635; 4 -3.185,-1.905; 5 3.185,-1.905; 6 3.185,-0.635; 7 3.185,0.635; 8 3.185,1.905
CD74HC165_SOIC-16 = smd 2 x 0.5: 1 -3.1,4.445; 2 -3.1,3.175; 3 -3.1,1.905; 4 -3.1,0.635; 5 -3.1,-0.635; 6 -3.1,-1.905; 7 -3.1,-3.175; 8 -3.1,-4.445; 9 3.1,-4.445; 10 3.1,-3.175; 11 3.1,-1.905; 12 3.1,-0.635; 13 3.1,0.635; 14 3.1,1.905; 15 3.1,3.175; 16 3.1,4.445
FXOS8700CQR1 = smd 0.8 x 0.3: P$1 -1.275,1; P$2 -1.275,0.5; P$3 -1.275,0; P$4 -1.275,-0.5; P$5 -1.275,-1; P$9 1.275,-1; P$10 1.275,-0.5; P$11 1.275,0; P$12 1.275,0.5; P$13 1.275,1 | smd 0.3 x 0.8: P$6 -0.5,-1.275; P$7 0,-1.275; P$8 0.5,-1.275; P$14 0.5,1.275; P$15 0,1.275; P$16 -0.5,1.275
MAX11613_UMAX-8 = smd 1.35 x 0.4: P$1 -2.15,0.975; P$2 -2.15,0.325; P$3 -2.15,-0.325; P$4 -2.15,-0.975; P$5 2.15,-0.975; P$6 2.15,-0.325; P$7 2.15,0.325; P$8 2.15,0.975
MOUNT_HOLE_150MIL = hole 3.81: 0,0
7MMX5MM = smd 1.4 x 2.2: P$1 -1.27,3.15; P$2 1.27,3.15; P$3 1.27,-3.15 | smd 1.4 x 2.4: P$4 -1.27,-3.05

### Placement (x,y rotation side)
3.3V  20.32,51.56 0 top
3.3V_PWR  29.21,39.37 180 top
5V  34.04,3.05 90 top
12V  115.18,2.86 180 top
C1  85.77,44.51 270 top
C2  93.34,34.92 270 top
C3  85.34,25.4 180 top
C4  75.95,34.16 90 top
C5  85.34,21.34 0 top
C6  13.21,60.45 180 top
C7  1.52,-95 0 top  (outside the outline)
C8  82.55,44.45 90 top
C9  126.36,25.53 180 top
C10  25.41,22.35 90 top
C11  1.52,-99.31 0 top  (outside the outline)
C12  1.52,-103.63 0 top  (outside the outline)
C13  29.21,4.06 90 top
C14  42.06,16.3 270 top
C15  51.49,7.5 180 top
C16  9.74,40.37 0 top
C17  9.99,37.79 0 top
C18  121.59,9.92 180 top
C19  109.27,9.91 180 top
C20  1.52,-107.95 0 top  (outside the outline)
C22  23.44,45.16 0 top
C23  23.44,41.39 0 top
C24  13.9,53.36 270 top
C25  134.37,35.81 90 top
C26  131.7,33.02 180 top
C27  29.9,11.99 180 top
C28  41.76,7.63 180 top
C29  39.58,22.35 90 top
C30  43.08,22.35 90 top
C31  52.58,44.45 180 top
C36  138.43,36.83 0 top
C37  138.43,35.05 0 top
C40  137.41,28.7 270 top
C41  137.67,20.83 0 top
C43  144.91,33.02 180 top
D2  129.21,3.88 90 top
D3  17.09,27.43 180 top
DISP1  21.59,66.8 270 top
FID1  7.62,60.2 0 top
FID2  149.1,21.34 0 top
FTDI_CABLE  66.55,31.5 90 top
GND  115.57,17.74 180 top
J1  22.86,-52.32 0 top  (outside the outline)
J6  19.81,-22.86 0 top  (outside the outline)
L3  20.1,8.39 90 top
R1  85.34,23.37 180 top
R2  39.37,15.24 180 top
R3  29.72,60.45 90 top
R4  31.5,60.45 90 top
R5  26.16,60.45 90 top
R6  27.94,60.45 90 top
R7  17.02,60.45 90 top
R8  22.35,60.45 90 top
R9  85.34,57.4 180 top
R10  76.96,57.4 180 top
R11  25.4,39.37 180 top
R12  132.84,28.7 270 top
R13  134.87,28.7 270 top
R14  20.57,60.45 90 top
R15  2.03,-68.58 0 top  (outside the outline)
R16  2.03,-71.88 0 top  (outside the outline)
R17  68.83,57.4 180 top
R18  18.8,60.45 90 top
R19  2.03,-75.18 0 top  (outside the outline)
R20  2.03,-78.49 0 top  (outside the outline)
R21  2.03,-81.79 0 top  (outside the outline)
R22  2.03,-85.09 0 top  (outside the outline)
R23  2.03,-88.39 0 top  (outside the outline)
R24  2.03,-91.69 0 top  (outside the outline)
R25  -3.81,-112.27 0 top  (outside the outline)
R26  -3.81,-115.57 0 top  (outside the outline)
R27  -3.81,-118.87 0 top  (outside the outline)
SW1  68.83,60.2 0 top
SW2  76.96,60.2 0 top
SW3  85.34,60.2 0 top
SW_D  85.34,67.56 0 top
SW_S  76.96,67.56 0 top
SW_U  68.83,67.56 0 top
SWITCHS  130.05,67.56 180 top
TAG_CONNECT  60.45,31.5 90 top
TVS1  137.32,13.49 270 top
U1  84.58,34.54 90 top
U5  32.43,27.19 0 top
U6  11.37,45.55 270 top
U7  52.58,40.64 0 top
U16  122.56,30.99 270 top
U27  135.89,32.51 0 top
U29  137.67,23.62 180 top
U$1  46.48,15.24 0 top
U$31  [MOUNT_HOLE_150MIL]  4.83,4.83 0 top
U$32  [MOUNT_HOLE_150MIL]  4.83,66.55 0 top
U$33  [MOUNT_HOLE_150MIL]  148.08,66.29 0 top
U$34  [MOUNT_HOLE_150MIL]  148.08,4.83 0 top
U$35  23.62,28.45 0 top
U$42  63.75,15.24 0 top
X1  -3.56,-102.87 0 top  (outside the outline)

### Tracks (layer width: path | path; a pad name or v marks a point on that pad's centre or on a via)
3.3V  (via drill 0.5)  (16 unrouted)
  Top 0.254: U1.30 82.98,43.12 C8.1 81.42,43.55 v81.28,43.69 | U1.18 92.86,35.34 C2.1 94.35,35.83 v94.61,35.56 | U1.8 86.18,25.46 87.06,25.46 v87.38,25.15 | U1.40 76.43,33.74 C4.1 74.94,33.26 v74.68,33.53 | U7.8 53.98,42.55 53.48,43.04 C31.1 53.48,45.58 v53.34,45.72 | C9.1 127,25.79 U16.16 v127,29.72 | U27.P$14 136.39,34.54 136.91,35.05 C37.1 C36.1 v136.4,36.83 | U27.P$1 133.87,33.51 133.1,34.29 v133.1,34.92 133.49,34.91 C25.1 | R17.1 71.12,57.4 v71.37,57.15 | R10.1 79.25,57.4 v79.5,57.15 | R9.1 87.63,57.4 v87.88,57.15 | C1.1 86.8,45.41 v87.12,45.09 | 53.85,34.8 v52.83,33.78 51.82,34.8 | R1.2 v83.31,23.37 | R12.2 v132.84,26.42 | v134.87,26.42 R13.2 | C41.1 136.82,22.19 136.36,22.65 U29.P$8 133.39,22.65 v133.35,22.61 | 147.45,34.67 147.07,34.29 146.05,34.29 145.76,34 C43.1 145.76,31.54 v145.8,31.5
  Top 0.305: 86.18,25.46 arc90 C3.1
  Bottom 0.254: v71.37,57.15 72.14,57.15 | v79.5,57.15 80.01,57.15 80.26,56.9 | v87.88,57.15 87.38,57.15 | 127,39.37 v127,29.72 129.03,29.72 131.7,27.05 | 97.03,40.89 94.61,38.48 v94.61,35.56 95.76,34.42 95.76,28.96 91.95,25.15 v87.38,25.15 85.6,23.37 v83.31,23.37 | v87.12,45.09 93.09,45.09 93.22,44.96 | 74.93,43.69 74.93,57.15 | v53.34,45.72 53.98,45.09 | 53.98,45.09 55.37,43.69 73.15,43.69 | 73.15,43.69 74.93,43.69 | v81.28,43.69 74.93,43.69 | v52.83,33.78 52.83,43.69 53.98,44.83 53.98,45.09 | v74.68,33.53 73.15,35.05 73.15,43.69 | v136.4,36.83 136.4,39.12 | v133.1,34.92 133.1,39.62 | v134.87,26.42 v132.84,26.42 132.33,26.42 131.7,27.05 | v133.35,22.61 132.59,22.61 130.3,24.89 130.3,25.65 131.7,27.05 | v145.8,31.5 145.8,30.99 145.03,30.23 143,30.23 141.73,31.5 141.73,38.35 140.72,39.37 138.49,39.37 138.43,39.43
  pour Top (isolate 0.305, no thermals): 7.87,44.96 10.67,44.96 18.29,37.34 23.37,37.34 23.37,50.29 18.29,55.37 15.24,55.37 13.97,54.1 13.97,49.41 10.79,46.23 7.87,46.23
5V  (7 unrouted)
  Top 0.813: U6.3 C16.1 | C16.1 | C16.1 8.83,38.03 C17.1 4.88,37.79 4.83,37.85 | C6.1 14.61,62.61 13.97,63.25 11.18,63.25 10.41,64.01 10.41,69.09 11.43,70.1 14.73,70.1 15.24,69.6 DISP1.P$13
  pour Top (isolate 0.305, no thermals): 34.54,16 34.54,5.84 32.51,3.81 22.61,3.81 22.1,4.32 18.29,4.32 18.29,1.02 53.34,1.02 53.34,6.6 36.32,6.6 35.43,7.49 35.43,16
12V  (9 unrouted)
  Top 0.254: R2.1 40.27,17.64 40.13,17.78
  pour Top (isolate 0.305, rank 2, no thermals): 23.88,21.59 23.88,17.78 25.15,16.51 29.46,16.51 29.46,13.72 30.23,13.72 30.23,16.51 44.7,16.51 44.7,21.84 38.1,21.84 34.8,18.54 27.43,18.54 26.67,19.3 26.67,21.59
12V_BATT  (3 unrouted)
165_CLK
  Top 0.254: U1.14 92.06,32.14 92.46,31.75 94.93,31.75 96.01,30.67 96.01,26.67 98.81,23.88 111.25,23.88 118.62,31.24 124.21,31.24 125.73,32.77 U16.2
165_DATA
  Top 0.254: U1.12 94.68,30.54 95,30.23 95,26.16 98.3,22.86 111.76,22.86 115.32,26.42 117.86,26.42 118.11,26.67 U16.9
165_LOAD
  Top 0.254: U1.13 92.1,31.34 92.2,31.24 94.79,31.24 95.5,30.52 95.5,26.42 98.55,23.37 111.51,23.37 118.87,30.73 125.22,30.73 127,32.51 U16.1
595_CLK
  Top 0.254: 103.25,26.8 102.62,26.16 99.31,26.16 97.54,27.94 97.54,34.08 94.92,36.69 92.57,36.69 92.02,36.14 U1.19
595_DATA
  Top 0.254: 107.06,26.29 105.92,25.15 98.81,25.15 96.52,27.43 96.52,30.78 95.04,32.26 92.71,32.26 92.02,32.94 U1.15
595_LAT
  Top 0.254: 104.52,26.8 103.38,25.65 99.06,25.65 97.03,27.69 97.03,30.97 95.23,32.77 92.96,32.77 91.99,33.74 U1.16
!RES!_PROP  (via drill 0.5)
  Top 0.254: TAG_CONNECT.P$6 58.67,32.77 58.17,33.27 58.17,36.32 59.69,37.85 FTDI_CABLE.6 | v83.31,21.34 C5.1
  Bottom 0.254: FTDI_CABLE.6 83.06,21.34 v83.31,21.34
A0  (3 unrouted)
A1  (3 unrouted)
A2  (3 unrouted)
A3  (3 unrouted)
D4
  Top 0.254: R6.2 27.94,62.74 29.21,64.01 29.21,66.8 DISP1.P$3
D5
  Top 0.254: R5.2 26.16,63.75 DISP1.P$4
D6
  Top 0.254: R4.2 31.5,62.48 33.02,64.01 33.02,66.8 31.75,68.07 DISP1.P$1
D7
  Top 0.254: R3.2 29.72,62.48 30.48,63.25 DISP1.P$2
E1
  Top 0.254: R8.2 22.35,63.5 DISP1.P$10
E2
  Top 0.254: R7.2 17.02,63.5 16.26,64.26 13.97,64.26 DISP1.P$16
GND  (via drill 0.5)  (144 unrouted)
  Top 0.254: U1.27 85.38,43.22 arc-90 C1.2 86.79,43.61 v87.12,43.94 | U1.17 92.83,34.54 C2.2 94.35,34.02 v94.61,34.29 | U1.6 84.58,26.92 | 84.58,26.92 84.58,25.54 C3.2 83.82,25.4 v83.31,24.89 | U1.5 83.78,27.31 84.17,26.92 84.58,26.92 | U1.39 76.47,34.54 C4.2 74.94,35.06 v74.68,34.8 | U7.7 52.96,41.27 51.68,42.56 C31.2 51.68,45.58 v51.82,45.72 | U7.3 47.12,40.01 v46.99,40.13 | U7.2 47.12,41.27 v46.99,41.4 | U7.4 47.12,38.73 v46.99,38.86 | TAG_CONNECT.P$5 61.21,32.77 61.72,32.26 62.23,32.26 64.26,34.29 v64.26,35.31 | C8.2 81.42,45.35 v81.28,45.21 | C9.2 125.73,25.79 U16.15 v125.73,29.72 | U16.8 v118.11,36.07 | SW3.P$4 88.84,59.12 v88.9,59.18 | SW2.P$4 80.46,59.12 v80.52,59.18 | SW1.P$4 72.33,59.12 v72.39,59.18 | U27.P$7 135.89,30.23 v136.14,29.97 | C40.2 v137.41,26.67 | v131.32,34.29 130.8,33.77 C26.2 130.8,32.14 130.94,32 133.1,32 133.6,32.51 U27.P$3 | U27.P$5 134.13,31.51 133.86,31.24 v133.86,30.73 | U27.P$13 139.33,33.51 | U27.P$12 139.33,33.01 | 139.33,33.01 139.33,33.51 | 139.33,33.51 C37.2 C36.2 v140.46,36.83 | U27.P$10 138.64,32.01 139.33,32.7 139.33,33.01 | U27.P$16 135.39,36.07 | 135.39,36.07 135.39,36.31 134.99,36.71 C25.2 | v135.64,36.07 135.39,36.07 | U29.P$7 136.72,23.3 138.52,21.5 C41.2 139.7,20.83 v139.95,20.57 | 144.91,34.92 144.02,34.04 | 144.02,33.06 144.02,31.75 v143.76,31.5 | 144.02,34.04 144.02,33.06 | 144.02,33.06 C43.2 | 143.64,34.42 144.02,34.04
  Top 0.61: C24.NEG 11.28,53.34 v9.14,53.34 | U6.1 10.67,47.85 v10.67,47.88 | C17.2 13.46,37.79 v13.46,37.85 | C16.2 11.94,40.37 v11.94,40.39 | C22.2 26.67,45.16 v26.67,45.21 | C23.2 v25.65,41.39 v25.65,41.4
  Top 0.813: C6.2 v9.91,60.45
  Bottom 0.254: v46.99,40.13 46.99,40.39 | v46.99,41.4 46.99,40.89 | v46.99,38.86 46.99,39.12 47.24,39.37 | v51.82,45.72 51.82,45.97 | v64.26,35.31 64.26,35.81 | v94.61,34.29 94.74,34.54 | v81.28,45.21 81.03,45.21 | v87.12,43.94 87.12,44.2 | 87.88,46.23 88.65,46.23 | v125.73,29.72 125.48,29.72 | v118.11,36.07 118.11,36.32 | v88.9,59.18 88.9,59.44 | v80.52,59.18 80.52,59.44 | v72.39,59.18 72.39,59.44 | v136.14,29.97 136.14,29.72 | v137.41,26.67 137.67,26.92 | v131.32,34.29 131.57,34.54 | v133.86,30.73 133.6,30.73 | v140.46,36.83 140.72,36.58 | v143.76,31.5 143.51,31.5
  Bottom 0.61: v9.14,53.34 9.14,53.85 | v13.46,37.85 13.46,38.35 | v11.94,40.39 11.94,40.64 | v26.67,45.21 26.67,45.47 | v25.65,41.4 25.65,41.66
  Bottom 0.813: v9.91,60.45 9.91,59.94
  other vias: 7.62,15.49 7.62,16.76 7.62,18.03 7.62,19.3 7.62,20.57 7.62,21.84 7.62,23.11 7.62,24.38 7.62,25.65 7.62,26.92 7.62,28.19 7.62,29.46 7.62,30.73 7.62,32 7.62,33.27 7.62,34.54 23.37,10.92 22.1,10.92 20.83,10.92 19.56,10.92 18.29,10.92 17.02,10.92 16.51,31.37 16.51,32.64 16.51,33.91 12.57,31.37 12.57,32.64 12.57,33.91 24.64,25.78 26.16,25.78 30.48,28.19 31.75,28.19 33.02,28.19 34.29,28.19 28.7,22.1 28.7,23.37 28.7,24.64 28.7,25.91 30.48,19.81 31.75,19.81 33.02,19.81 34.29,19.81 36.07,22.1 36.07,23.37 36.07,24.64 36.07,25.91 42.42,25.78 43.94,25.78 38.86,25.78 40.39,25.78 28.45,7.24 29.97,7.24 40.26,9.78 40.26,11.05 40.26,12.32 40.26,13.59 43.31,9.78 43.31,11.05 43.31,12.32 43.31,13.59 49.91,9.53 49.91,10.79 49.91,12.06 49.91,13.34 52.96,9.53 52.96,10.79 52.96,12.06 52.96,13.34 32.38,12.57 32.38,11.56 32.38,10.54 74.68,11.81 74.68,13.08 74.68,14.35 74.68,15.62 77.72,11.81 77.72,13.08 77.72,14.35 77.72,15.62
  pour Bottom (isolate 0.406, rank 6): 0,5.08 0,66.04 arc-90 5.08,71.12 147.83,71.12 arc-90 152.91,66.04 152.91,5.08 arc-90 147.83,0 5.08,0 arc-90
N$1  (1 unrouted)
N$2
  Top 0.254: C27.1 30.8,12.76 31.16,13.13 U5.P$3
N$3  (1 unrouted)
N$4  (1 unrouted)
N$5  (3 unrouted)
  Top 0.254: 29,12.66 28.62,13.04 U5.P$1
  pour Top (isolate 0.305, no thermals): 11.68,26.92 11.68,15.49 14.99,12.19 26.42,12.19 27.69,13.46 28.96,13.46 28.96,16 24.89,16 22.61,18.29 22.61,26.92
N$6  (1 unrouted)
N$7
  Top 0.254: C26.1 U27.P$2
N$8
  Top 0.254: U27.P$8 136.39,30.74 136.65,30.48 137.16,30.48 137.41,30.23 C40.1
N$9  (1 unrouted)
N$10  (1 unrouted)
N$11  (1 unrouted)
N$12  (1 unrouted)
N$31
  Top 0.254: U5.P$7 38.47,14.79 R2.2
P9
  Top 0.254: U1.10 87.78,26.77 93.98,20.57 129.54,20.57 133.48,24.51 | 133.48,24.51 133.86,24.89 133.86,29.21 134.2,29.55 | 134.04,23.95 133.48,24.51
P10  (via drill 0.5)
  Top 0.254: U1.11 88.58,26.73 94.23,21.08 129.29,21.08 131.83,23.62 v131.83,25.15 131.83,29.21 132.17,29.55 | 136.36,24.6 v136.91,25.15
  Bottom 0.254: v136.91,25.15 v131.83,25.15
PROP_D4
  Top 0.254: R6.1 27.94,54.61 59.94,22.61 72.39,22.61 75.95,26.16 75.95,29.21 77.28,30.54 U1.44
PROP_D5
  Top 0.254: R5.1 26.16,55.63 60.71,21.08 75.95,21.08 80.58,25.72 U1.1
PROP_D6
  Top 0.254: R4.1 31.5,52.58 60.45,23.62 71.88,23.62 74.93,26.67 74.93,29.72 77.36,32.14 U1.42
PROP_D7
  Top 0.254: R3.1 29.72,53.59 60.2,23.11 72.14,23.11 75.44,26.42 75.44,29.46 77.32,31.34 U1.43
PROP_E1
  Top 0.254: R8.1 22.35,58.67 60.45,20.57 76.2,20.57 81.38,25.76 U1.2
PROP_E2
  Top 0.254: R7.1 17.02,58.93 17.53,58.42 18.54,58.42 57.91,19.05 86.11,19.05 88.16,21.11 88.16,25.63 86.98,26.81 U1.9
PROP_R/W
  Top 0.254: R14.1 20.57,58.93 59.44,20.07 76.45,20.07 82.18,25.79 U1.3
PROP_RES  (1 unrouted)
  Top 0.254: U1.7 85.38,23.58 85.6,23.37 R1.1
PROP_RS
  Top 0.254: R18.1 18.8,58.93 58.17,19.56 76.71,19.56 82.04,24.89 82.98,25.83 U1.4
R/W
  Top 0.254: R14.2 20.57,62.74 19.05,64.26 19.05,66.8 DISP1.P$9
RS
  Top 0.254: R18.2 18.8,62.74 17.78,63.75 DISP1.P$12
RX_PROP
  Top 0.254: TAG_CONNECT.P$4 58.67,31.5 58.17,30.99 58.17,28.19 58.93,27.43 61.21,27.43 FTDI_CABLE.4 70.36,32.77 73.41,35.81 76.96,35.81 77.43,35.34 U1.38
SCL  (2 unrouted)
  Top 0.254: U1.35 72.24,37.74 69.98,40.01 U7.6 52.96,40.01 51.82,38.86 | U27.P$4 133.87,32.01 132.84,30.99 R12.1
SDA  (2 unrouted)
  Top 0.254: U1.36 71.77,36.94 69.34,39.37 65.02,39.37 64.39,38.73 U7.5 54.23,38.73 53.85,38.35 | U27.P$6 135.39,30.74 134.87,30.23 R13.1
SW_D  (1 unrouted)
  Top 0.254: SW3.P$1 84.07,62.08 84.44,61.71 R9.2 84.44,55.26 84.84,54.86 89.66,54.86 91.95,52.58 91.95,38.86 91.63,38.54 U1.22
SW_S  (1 unrouted)
  Top 0.254: SW2.P$1 75.69,62.08 76.06,61.71 R10.2 76.06,55.26 76.96,54.36 89.41,54.36 91.44,52.32 91.44,44.96 88.58,42.1 U1.23
SW_U  (1 unrouted)
  Top 0.254: SW1.P$1 67.56,62.08 67.93,61.71 R17.2 67.93,56.02 70.1,53.85 89.15,53.85 90.93,52.07 90.93,45.21 87.78,42.06 U1.24
TC_CS_0
  Top 0.254: U1.25 86.98,42.02 90.42,45.47 90.42,51.82 88.9,53.34 78.99,53.34 73.91,48.26 61.21,48.26 60.58,48.9
TC_CS_1
  Top 0.254: U1.26 86.18,41.99 89.92,45.72 89.92,51.56 88.65,52.83 79.25,52.83 74.17,47.75 60.2,47.75 59.94,47.5 58.93,47.5 58.67,47.75 53.59,47.75 53.21,48.13 52.7,48.64
TC_CS_2
  Top 0.254: U1.31 82.18,41.52 76.45,47.24 60.45,47.24 60.2,46.99 58.67,46.99 58.42,47.24 46.35,47.24 44.83,48.77
TC_CS_3
  Top 0.254: U1.32 81.38,41.55 76.2,46.74 60.71,46.74 60.45,46.48 58.42,46.48 58.17,46.74 38.86,46.74 36.96,48.64
TC_SCK  (via drill 0.5)
  Top 0.254: v35.56,52.32 35.69,52.2 | 43.56,48.39 v43.69,48.26 | 51.44,48.39 v51.56,48.26 | 59.31,48.39 v59.44,48.26 | U1.34 77.03,38.54 76.45,39.12 76.45,43.94 75.44,44.96 73.15,44.96 v72.14,45.97
  Bottom 0.254: v35.56,52.32 35.69,52.2 35.69,50.62 38.05,48.26 v43.69,48.26 v51.56,48.26 v59.44,48.26 69.85,48.26 71.37,46.74 v72.14,45.97
TC_SO  (via drill 0.5)
  Top 0.254: v38.35,49.02 38.23,49.15 | 46.1,49.15 v46.23,49.02 | 53.98,49.15 v54.1,49.02 | 61.85,49.15 v61.98,49.02 | U1.33 80.58,41.34 75.95,45.97 v73.15,45.97
  Bottom 0.254: v38.35,49.02 v46.23,49.02 v54.1,49.02 v61.98,49.02 70.1,49.02 v73.15,45.97
TX_PROP
  Top 0.254: TAG_CONNECT.P$3 62.74,31.5 FTDI_CABLE.5 72.14,35.31 73.15,36.32 77.22,36.32 77.39,36.14 U1.37
X0  (1 unrouted)
  Top 0.254: U1.29 83.78,46.52 arc90 82.55,47.75 81.1,47.75
X1  (1 unrouted)
  Top 0.254: U1.28 84.58,48.9 arc-90 85.98,50.29 87.3,50.29